# Altium schematic sheet ct_fpga_io.SchDoc: FPGA I/O
size Letter; Organization: NewAE Technology Inc.; Address1: 1083 Queen St., Suite 196; Address2: Halifax; Address3: NS; Address4: Canada B3H 0B2; SheetNumber: 2; SheetTotal: 8; SheetApproved: YES
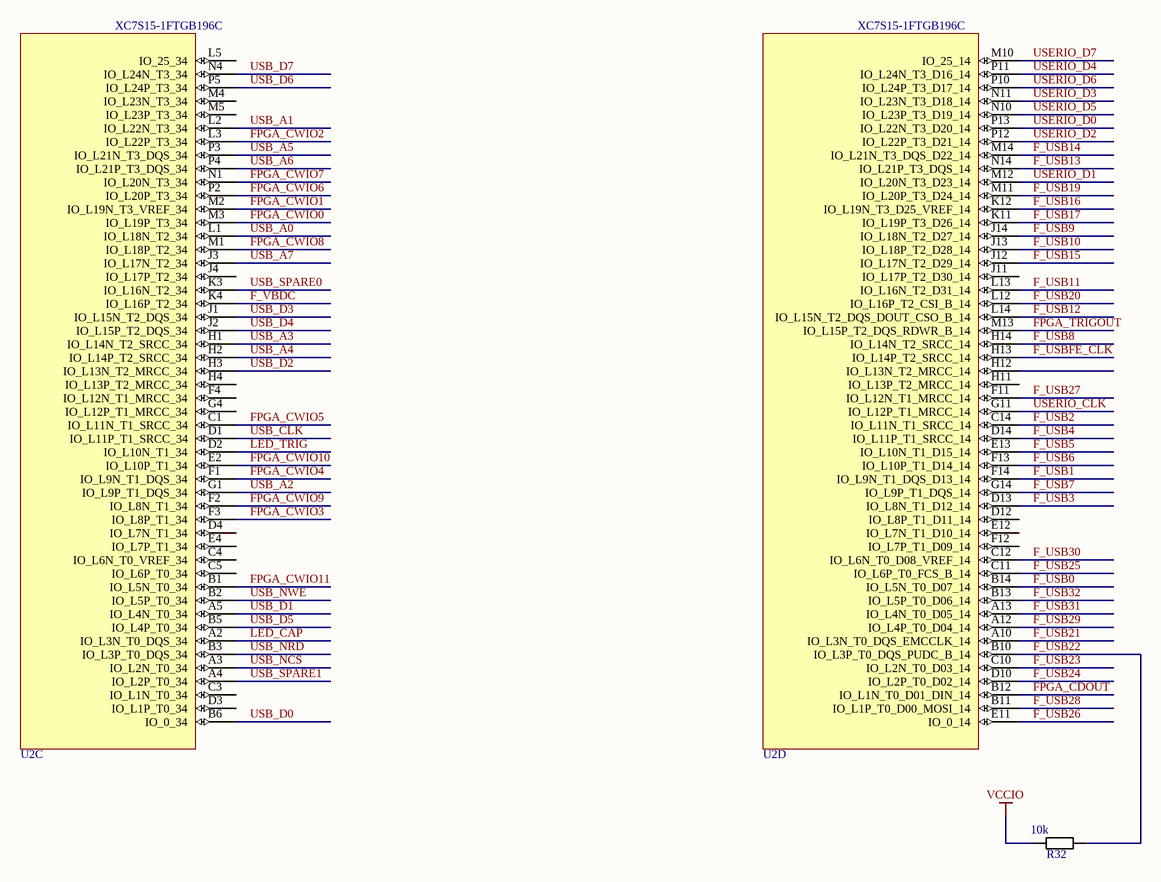
[diagram p0: ct_fpga_io.SchDoc]

## Parts
R32  10k  [RESC1608X55N]
U2  XC7S15-1FTGB196C  [BGA_FTGB196]  (parts C,D of 4)

## Nets
VCCIO: R32.1
F_USB0: U2.B14(IO_L5N_T0_D07_14)
F_USB1: U2.F14(IO_L9N_T1_DQS_D13_14)
F_USB2: U2.C14(IO_L11N_T1_SRCC_14)
F_USB3: U2.D13(IO_L8N_T1_D12_14)
F_USB4: U2.D14(IO_L11P_T1_SRCC_14)
F_USB5: U2.E13(IO_L10N_T1_D15_14)
F_USB6: U2.F13(IO_L10P_T1_D14_14)
F_USB7: U2.G14(IO_L9P_T1_DQS_14)
F_USB8: U2.H14(IO_L14N_T2_SRCC_14)
F_USB9: U2.J14(IO_L18N_T2_D27_14)
F_USB10: U2.J13(IO_L18P_T2_D28_14)
F_USB11: U2.L13(IO_L16N_T2_D31_14)
F_USB12: U2.L14(IO_L15N_T2_DQS_DOUT_CSO_B_14)
F_USB13: U2.N14(IO_L21P_T3_DQS_14)
F_USB14: U2.M14(IO_L21N_T3_DQS_D22_14)
F_USB15: U2.J12(IO_L17N_T2_D29_14)
F_USB16: U2.K12(IO_L19N_T3_D25_VREF_14)
F_USB17: U2.K11(IO_L19P_T3_D26_14)
F_USB19: U2.M11(IO_L20P_T3_D24_14)
F_USB20: U2.L12(IO_L16P_T2_CSI_B_14)
F_USB21: U2.A10(IO_L3N_T0_DQS_EMCCLK_14)
F_USB22: R32.2 U2.B10(IO_L3P_T0_DQS_PUDC_B_14)
F_USB23: U2.C10(IO_L2N_T0_D03_14)
F_USB24: U2.D10(IO_L2P_T0_D02_14)
F_USB25: U2.C11(IO_L6P_T0_FCS_B_14)
F_USB26: U2.E11(IO_0_14)
F_USB27: U2.F11(IO_L12N_T1_MRCC_14)
F_USB28: U2.B11(IO_L1P_T0_D00_MOSI_14)
F_USB29: U2.A12(IO_L4P_T0_D04_14)
F_USB30: U2.C12(IO_L6N_T0_D08_VREF_14)
F_USB31: U2.A13(IO_L4N_T0_D05_14)
F_USB32: U2.B13(IO_L5P_T0_D06_14)
F_USBFE_CLK: U2.H13(IO_L14P_T2_SRCC_14)
F_VBDC: U2.K4(IO_L16P_T2_34)
FPGA_CDOUT: U2.B12(IO_L1N_T0_D01_DIN_14)
FPGA_CWIO0: U2.M3(IO_L19P_T3_34)
FPGA_CWIO1: U2.M2(IO_L19N_T3_VREF_34)
FPGA_CWIO2: U2.L3(IO_L22P_T3_34)
FPGA_CWIO3: U2.F3(IO_L8P_T1_34)
FPGA_CWIO4: U2.F1(IO_L9N_T1_DQS_34)
FPGA_CWIO5: U2.C1(IO_L11N_T1_SRCC_34)
FPGA_CWIO6: U2.P2(IO_L20P_T3_34)
FPGA_CWIO7: U2.N1(IO_L20N_T3_34)
FPGA_CWIO8: U2.M1(IO_L18P_T2_34)
FPGA_CWIO9: U2.F2(IO_L8N_T1_34)
FPGA_CWIO10: U2.E2(IO_L10P_T1_34)
FPGA_CWIO11: U2.B1(IO_L5N_T0_34)
FPGA_TRIGOUT: U2.M13(IO_L15P_T2_DQS_RDWR_B_14)
LED_CAP: U2.A2(IO_L3N_T0_DQS_34)
LED_TRIG: U2.D2(IO_L10N_T1_34)
USB_A0: U2.L1(IO_L18N_T2_34)
USB_A1: U2.L2(IO_L22N_T3_34)
USB_A2: U2.G1(IO_L9P_T1_DQS_34)
USB_A3: U2.H1(IO_L14N_T2_SRCC_34)
USB_A4: U2.H2(IO_L14P_T2_SRCC_34)
USB_A5: U2.P3(IO_L21N_T3_DQS_34)
USB_A6: U2.P4(IO_L21P_T3_DQS_34)
USB_A7: U2.J3(IO_L17N_T2_34)
USB_CLK: U2.D1(IO_L11P_T1_SRCC_34)
USB_D0: U2.B6(IO_0_34)
USB_D1: U2.A5(IO_L4N_T0_34)
USB_D2: U2.H3(IO_L13N_T2_MRCC_34)
USB_D3: U2.J1(IO_L15N_T2_DQS_34)
USB_D4: U2.J2(IO_L15P_T2_DQS_34)
USB_D5: U2.B5(IO_L4P_T0_34)
USB_D6: U2.P5(IO_L24P_T3_34)
USB_D7: U2.N4(IO_L24N_T3_34)
USB_NCS: U2.A3(IO_L2N_T0_34)
USB_NRD: U2.B3(IO_L3P_T0_DQS_34)
USB_NWE: U2.B2(IO_L5P_T0_34)
USB_SPARE0: U2.K3(IO_L16N_T2_34)
USB_SPARE1: U2.A4(IO_L2P_T0_34)
USERIO_CLK: U2.G11(IO_L12P_T1_MRCC_14)
USERIO_D0: U2.P13(IO_L22N_T3_D20_14)
USERIO_D1: U2.M12(IO_L20N_T3_D23_14)
USERIO_D2: U2.P12(IO_L22P_T3_D21_14)
USERIO_D3: U2.N11(IO_L23N_T3_D18_14)
USERIO_D4: U2.P11(IO_L24N_T3_D16_14)
USERIO_D5: U2.N10(IO_L23P_T3_D19_14)
USERIO_D6: U2.P10(IO_L24P_T3_D17_14)
USERIO_D7: U2.M10(IO_25_14)

Not connected (* = marked no-connect by the designer): U2 C3(IO_L1N_T0_34) C4(IO_L6N_T0_VREF_34) C5(IO_L6P_T0_34) D3(IO_L1P_T0_34) D4(IO_L7N_T1_34) D12(IO_L8P_T1_D11_14) E4(IO_L7P_T1_34) E12(IO_L7N_T1_D10_14) F4(IO_L12N_T1_MRCC_34) F12(IO_L7P_T1_D09_14) G4(IO_L12P_T1_MRCC_34) H4(IO_L13P_T2_MRCC_34) H11(IO_L13P_T2_MRCC_14) H12(IO_L13N_T2_MRCC_14) J4(IO_L17P_T2_34) J11(IO_L17P_T2_D30_14) L5(IO_25_34) M4(IO_L23N_T3_34) M5(IO_L23P_T3_34)

## Notes on the sheet
- Title:
- Date:
- Rev:
- Time:
- Project:
- Sheet
- of
- License:
- Copyright © NewAE Technology Inc.
- Approved:
- NewAE.com
- File:

## Library data of the parts
R32 = RCHIP-10K-0603: 10k res, 0603, 1%, 1/10W; Manufacture 1: Yageo; Manufacture Part Number 1: RC0603FR-0710KL; Component Group: Resistor; Case-EIA: 0603; Case-Metric: 1608; Rated Power: 0.1W; Rated Voltage: 75VDC; Part Number: RCHIP-10K-0603; Footprint: 0603; Pin Count: 2; Supplier 1: Digi-Key; Supplier Part Number 1: 311-10.0KHRCT-ND; Value: 10k; Tolerance: 1%; Mounting Technology: SMT; Temperature Range: -55C to 155C; Component Kind: Standard; Component Type: Standard
U2 = XC7S15-1FTGB196C: Xilinx Spartan 7 FPGA, 196FTGB; Component Group: Digital IC; PP Material Stack: 0; Part Number: XC7S15-1FTGB196C; Manufacture 1: Xilinx; Manufacture Part Number 1: XC7S15-1FTGB196C; Pin Count: 196; Supplier 1: Digi-Key; Supplier Part Number 1: 122-2226-ND; Mounting Technology: SMT; Component Kind: Standard; Component Type: Standard; PP Rotation: 0